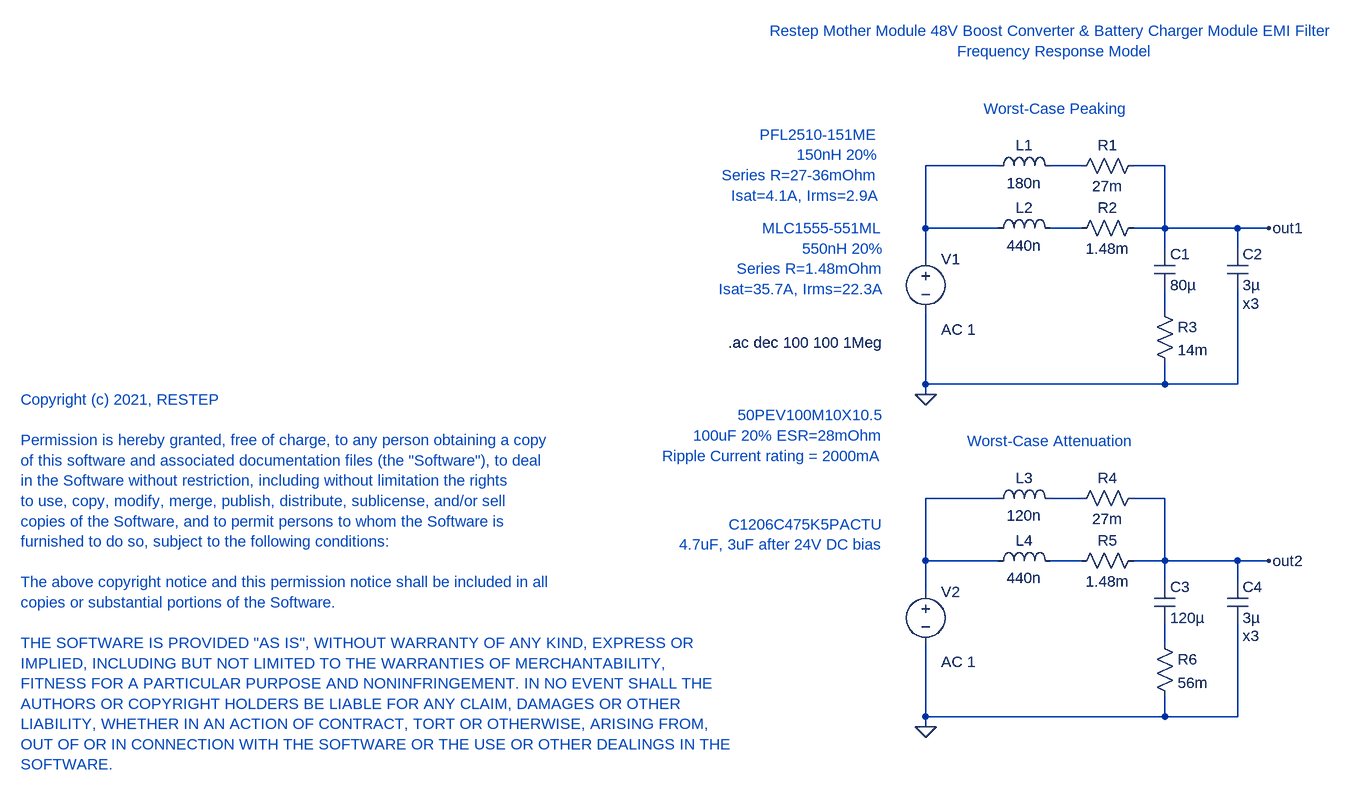
[diagram p0: schematic RESTEP-BoostAndBattery-EMIfilter-Freq.asc]
RESTEP-BoostAndBattery-EMIfilter-Freq.asc, the LTspice schematic file:
Version 4
SHEET 1 880 868
WIRE -1088 -16 -1200 -16
WIRE -960 -16 -1008 -16
WIRE -832 -16 -880 -16
WIRE -1200 80 -1200 -16
WIRE -1088 80 -1200 80
WIRE -960 80 -1008 80
WIRE -832 80 -832 -16
WIRE -832 80 -880 80
WIRE -720 80 -832 80
WIRE -672 80 -720 80
WIRE -832 112 -832 80
WIRE -720 112 -720 80
WIRE -1200 128 -1200 80
WIRE -832 208 -832 176
WIRE -1200 320 -1200 208
WIRE -832 320 -832 288
WIRE -832 320 -1200 320
WIRE -720 320 -720 176
WIRE -720 320 -832 320
WIRE -1200 336 -1200 320
WIRE -1088 496 -1200 496
WIRE -960 496 -1008 496
WIRE -832 496 -880 496
WIRE -1200 592 -1200 496
WIRE -1088 592 -1200 592
WIRE -960 592 -1008 592
WIRE -832 592 -832 496
WIRE -832 592 -880 592
WIRE -720 592 -832 592
WIRE -672 592 -720 592
WIRE -832 624 -832 592
WIRE -720 624 -720 592
WIRE -1200 640 -1200 592
WIRE -832 720 -832 688
WIRE -1200 832 -1200 720
WIRE -832 832 -832 800
WIRE -832 832 -1200 832
WIRE -720 832 -720 688
WIRE -720 832 -832 832
WIRE -1200 848 -1200 832
FLAG -672 80 out1
FLAG -1200 336 0
FLAG -672 592 out2
FLAG -1200 848 0
SYMBOL voltage -1200 112 R0
WINDOW 123 24 124 Left 2
WINDOW 39 0 0 Left 2
SYMATTR Value2 AC 1
SYMATTR InstName V1
SYMATTR Value ""
SYMBOL ind -1104 0 R270
WINDOW 0 32 56 VTop 2
WINDOW 3 5 56 VBottom 2
SYMATTR InstName L1
SYMATTR Value 180n
SYMBOL ind -1104 96 R270
WINDOW 0 32 56 VTop 2
WINDOW 3 5 56 VBottom 2
SYMATTR InstName L2
SYMATTR Value 440n
SYMBOL res -864 -32 R90
WINDOW 0 0 56 VBottom 2
WINDOW 3 32 56 VTop 2
SYMATTR InstName R1
SYMATTR Value 27m
SYMBOL res -864 64 R90
WINDOW 0 0 56 VBottom 2
WINDOW 3 32 56 VTop 2
SYMATTR InstName R2
SYMATTR Value 1.48m
SYMBOL cap -848 112 R0
SYMATTR InstName C1
SYMATTR Value 80µ
SYMBOL res -848 192 R0
SYMATTR InstName R3
SYMATTR Value 14m
SYMBOL cap -736 112 R0
WINDOW 123 24 84 Left 2
SYMATTR Value2 x3
SYMATTR InstName C2
SYMATTR Value 3µ
SYMBOL ind -1104 512 R270
WINDOW 0 32 56 VTop 2
WINDOW 3 5 56 VBottom 2
SYMATTR InstName L3
SYMATTR Value 120n
SYMBOL ind -1104 608 R270
WINDOW 0 32 56 VTop 2
WINDOW 3 5 56 VBottom 2
SYMATTR InstName L4
SYMATTR Value 440n
SYMBOL res -864 480 R90
WINDOW 0 0 56 VBottom 2
WINDOW 3 32 56 VTop 2
SYMATTR InstName R4
SYMATTR Value 27m
SYMBOL res -864 576 R90
WINDOW 0 0 56 VBottom 2
WINDOW 3 32 56 VTop 2
SYMATTR InstName R5
SYMATTR Value 1.48m
SYMBOL cap -848 624 R0
SYMATTR InstName C3
SYMATTR Value 120µ
SYMBOL res -848 704 R0
SYMATTR InstName R6
SYMATTR Value 56m
SYMBOL cap -736 624 R0
WINDOW 123 24 84 Left 2
SYMATTR Value2 x3
SYMATTR InstName C4
SYMATTR Value 3µ
SYMBOL voltage -1200 624 R0
WINDOW 123 24 124 Left 2
WINDOW 39 0 0 Left 2
SYMATTR Value2 AC 1
SYMATTR InstName V2
SYMATTR Value ""
TEXT -1264 80 Right 2 ;MLC1555-551ML\n550nH 20%\nSeries R=1.48mOhm\nIsat=35.7A, Irms=22.3A
TEXT -1272 -64 Right 2 ;PFL2510-151ME\n150nH 20%\nSeries R=27-36mOhm\nIsat=4.1A, Irms=2.9A
TEXT -1264 368 Right 2 ;50PEV100M10X10.5\n100uF 20% ESR=28mOhm\nRipple Current rating = 2000mA
TEXT -1264 536 Right 2 ;C1206C475K5PACTU\n4.7uF, 3uF after 24V DC bias
TEXT -1504 256 Left 2 !.ac dec 100 100 1Meg
TEXT -1000 -208 Center 2 ;Restep Mother Module 48V Boost Converter & Battery Charger Module EMI Filter \nFrequency Response Model
TEXT -1000 -104 Center 2 ;Worst-Case Peaking
TEXT -1008 408 Center 2 ;Worst-Case Attenuation
TEXT -2592 344 Left 2 ;Copyright (c) 2021, RESTEP\n \nPermission is hereby granted, free of charge, to any person obtaining a copy\nof this software and associated documentation files (the "Software"), to deal\nin the Software without restriction, including without limitation the rights\nto use, copy, modify, merge, publish, distribute, sublicense, and/or sell\ncopies of the Software, and to permit persons to whom the Software is\nfurnished to do so, subject to the following conditions:\n \nThe above copyright notice and this permission notice shall be included in all\ncopies or substantial portions of the Software.\n \nTHE SOFTWARE IS PROVIDED "AS IS", WITHOUT WARRANTY OF ANY KIND, EXPRESS OR\nIMPLIED, INCLUDING BUT NOT LIMITED TO THE WARRANTIES OF MERCHANTABILITY,\nFITNESS FOR A PARTICULAR PURPOSE AND NONINFRINGEMENT. IN NO EVENT SHALL THE\nAUTHORS OR COPYRIGHT HOLDERS BE LIABLE FOR ANY CLAIM, DAMAGES OR OTHER\nLIABILITY, WHETHER IN AN ACTION OF CONTRACT, TORT OR OTHERWISE, ARISING FROM,\nOUT OF OR IN CONNECTION WITH THE SOFTWARE OR THE USE OR OTHER DEALINGS IN THE\nSOFTWARE.

The netlist it stands for:
* RESTEP-BoostAndBattery-EMIfilter-Freq.asc
V1 N001 0 AC 1
L1 N001 N002 180n
L2 N001 N003 440n
R1 out1 N002 27m
R2 out1 N003 1.48m
C1 out1 N004 80µ
R3 N004 0 14m
C2 out1 0 3µ x3
L3 N005 N006 120n
L4 N005 N007 440n
R4 out2 N006 27m
R5 out2 N007 1.48m
C3 out2 N008 120µ
R6 N008 0 56m
C4 out2 0 3µ x3
V2 N005 0 AC 1
* MLC1555-551ML
* 550nH 20%
* Series R=1.48mOhm
* Isat=35.7A, Irms=22.3A
* PFL2510-151ME
* 150nH 20%
* Series R=27-36mOhm
* Isat=4.1A, Irms=2.9A
* 50PEV100M10X10.5
* 100uF 20% ESR=28mOhm
* Ripple Current rating = 2000mA
* C1206C475K5PACTU
* 4.7uF, 3uF after 24V DC bias
.ac dec 100 100 1Meg
* Restep Mother Module 48V Boost Converter & Battery Charger Module EMI Filter
* Frequency Response Model
* Worst-Case Peaking
* Worst-Case Attenuation
* Copyright (c) 2021, RESTEP
* Permission is hereby granted, free of charge, to any person obtaining a copy
* of this software and associated documentation files (the "Software"), to deal
* in the Software without restriction, including without limitation the rights
* to use, copy, modify, merge, publish, distribute, sublicense, and/or sell
* copies of the Software, and to permit persons to whom the Software is
* furnished to do so, subject to the following conditions:
* The above copyright notice and this permission notice shall be included in all
* copies or substantial portions of the Software.
* THE SOFTWARE IS PROVIDED "AS IS", WITHOUT WARRANTY OF ANY KIND, EXPRESS OR
* IMPLIED, INCLUDING BUT NOT LIMITED TO THE WARRANTIES OF MERCHANTABILITY,
* FITNESS FOR A PARTICULAR PURPOSE AND NONINFRINGEMENT. IN NO EVENT SHALL THE
* AUTHORS OR COPYRIGHT HOLDERS BE LIABLE FOR ANY CLAIM, DAMAGES OR OTHER
* LIABILITY, WHETHER IN AN ACTION OF CONTRACT, TORT OR OTHERWISE, ARISING FROM,
* OUT OF OR IN CONNECTION WITH THE SOFTWARE OR THE USE OR OTHER DEALINGS IN THE
* SOFTWARE.
.backanno
.end